# EAGLE design ButtonBoard (EAGLE 5.11)
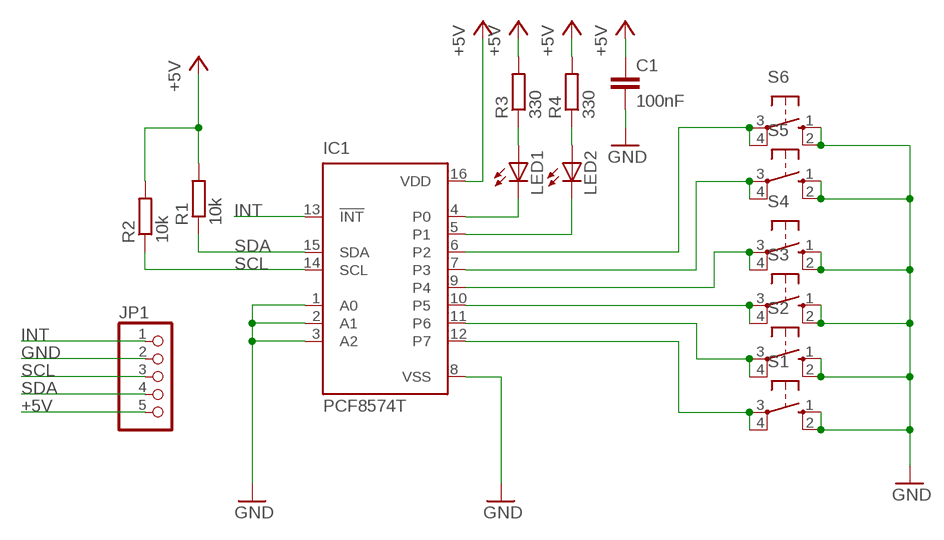
[diagram p0: schematic, sheet 1]

## Parts
C1  100nF  C-EUC0805  [C0805]
IC1  PCF8574T  [SO16W]
JP1  PINHD-1X5  [1X05]
LED1  LEDCHIPLED_1206  [CHIPLED_1206]
LED2  LEDCHIPLED_1206  [CHIPLED_1206]
R1  10k  R-EU_R0805  [R0805]
R2  10k  R-EU_R0805  [R0805]
R3  330  R-EU_R0805  [R0805]
R4  330  R-EU_R0805  [R0805]
S1  10-XX  [B3F-10XX]
S2  10-XX  [B3F-10XX]
S3  10-XX  [B3F-10XX]
S4  10-XX  [B3F-10XX]
S5  10-XX  [B3F-10XX]
S6  10-XX  [B3F-10XX]

## Nets
+5V: C1.1 IC1.16(VDD) JP1.5 R1.2 R2.2 R3.2 R4.2
GND: C1.2 IC1.1(A0) IC1.2(A1) IC1.3(A2) IC1.8(VSS) JP1.2 S1.1(S) S1.2(S1) S2.1(S) S2.2(S1) S3.1(S) S3.2(S1) S4.1(S) S4.2(S1) S5.1(S) S5.2(S1) S6.1(S) S6.2(S1)
INT: IC1.13(!INT) JP1.1
N$1: IC1.9(P4) S4.3(P) S4.4(P1)
N$2: IC1.5(P1) LED2.C
N$3: IC1.4(P0) LED1.C
N$4: LED1.A R3.1
N$5: IC1.12(P7) S1.3(P) S1.4(P1)
N$6: IC1.11(P6) S2.3(P) S2.4(P1)
N$7: IC1.10(P5) S3.3(P) S3.4(P1)
N$8: LED2.A R4.1
N$9: IC1.7(P3) S5.3(P) S5.4(P1)
N$10: IC1.6(P2) S6.3(P) S6.4(P1)
SCL: IC1.14(SCL) JP1.3 R2.1
SDA: IC1.15(SDA) JP1.4 R1.1

## Library data of the parts
C1 = rcl:C-EU: CAPACITOR, European symbol
IC1 = micro-philips:PCF8574: I2C-Bus Remote 8-bit I/O expander http://www.semiconductors.philips.com/acrobat_download/datasheets/PCF8574_4.pdf; MPN: PCF8574T/3,512; OC_FARNELL: 1201255; OC_NEWARK: 70R6870
JP1 = pinhead:PINHD-1X5: PIN HEADER
LED1 LED2 = led:LED: LED OSRAM: - CHIPLED LG R971, LG N971, LY N971, LG Q971, LY Q971, LO R971, LY R971 LH N974, LH R974 LS Q976, LO Q976, LY Q976 LO Q996 - Hyper CHIPLED LW Q18S LB Q993, LB Q99A, LB R99A - SideLED LS A670, LO A670, LY A670, LG A670, LP A670 LB A673, LV A673, LT A673, LW A673 LH A674 LY A675 LS A676, LA A676, LO A676, LY A676, LW A676 LS A679, LY A679, LG A679 - Hyper Micro SIDELED® LS Y876, LA Y876, LO Y876, LY Y876 LT Y87S - SmartLED LW L88C, LW L88S LB L89C, LB L89S, LG L890 LS L89K, LO L89K, LY L89K LS L896, LA L896, LO L896, LY L896 - TOPLED LS T670, LO T670, LY T670, LG T670, LP T670 LSG T670, LSP T670, LSY T670, LOP T670, LYG T670 LG T671, LOG T671, LSG T671 LB T673, LV T673, LT T673, LW T673 LH T674 LS T676, LA T676, LO T676, LY T676, LB T676, LH T676, LSB T676, LW T676 LB T67C, LV T67C, LT T67C, LS T67K, LO T67K, LY T67K, LW E67C LS E67B, LA E67B, LO E67B, LY E67B, LB E67C, LV E67C, LT E67C LW T67C LS T679, LY T679, LG T679 LS T770, LO T770, LY T770, LG T770, LP T770 LB T773, LV T773, LT T773, LW T773 LH T774 LS E675, LA E675, LY E675, LS T675 LS T776, LA T776, LO T776, LY T776, LB T776 LHGB T686 LT T68C, LB T68C - Hyper Mini TOPLED® LB M676 - Mini TOPLED Santana® LG M470 LS M47K, LO M47K, LY M47K Source: http://www.osram.convergy.de LUXEON: - LUMILED® LXK2-PW12-R00, LXK2-PW12-S00, LXK2-PW14-U00, LXK2-PW14-V00 LXK2-PM12-R00, LXK2-PM12-S00, LXK2-PM14-U00 LXK2-PE12-Q00, LXK2-PE12-R00, LXK2-PE12-S00, LXK2-PE14-T00, LXK2-PE14-U00 LXK2-PB12-K00, LXK2-PB12-L00, LXK2-PB12-M00, LXK2-PB14-N00, LXK2-PB14-P00, LXK2-PB14-Q00 LXK2-PR12-L00, LXK2-PR12-M00, LXK2-PR14-Q00, LXK2-PR14-R00 LXK2-PD12-Q00, LXK2-PD12-R00, LXK2-PD12-S00 LXK2-PH12-R00, LXK2-PH12-S00 LXK2-PL12-P00, LXK2-PL12-Q00, LXK2-PL12-R00 Source: www.luxeon.com KINGBRIGHT: KA-3528ASYC Source: www.kingbright.com
R1-R4 = rcl:R-EU_: RESISTOR, European symbol
S1-S6 = switch-omron:10-XX: OMRON SWITCH; MPN: B3F-1000; OC_FARNELL: 176432; OC_NEWARK: 36M3542

## Board
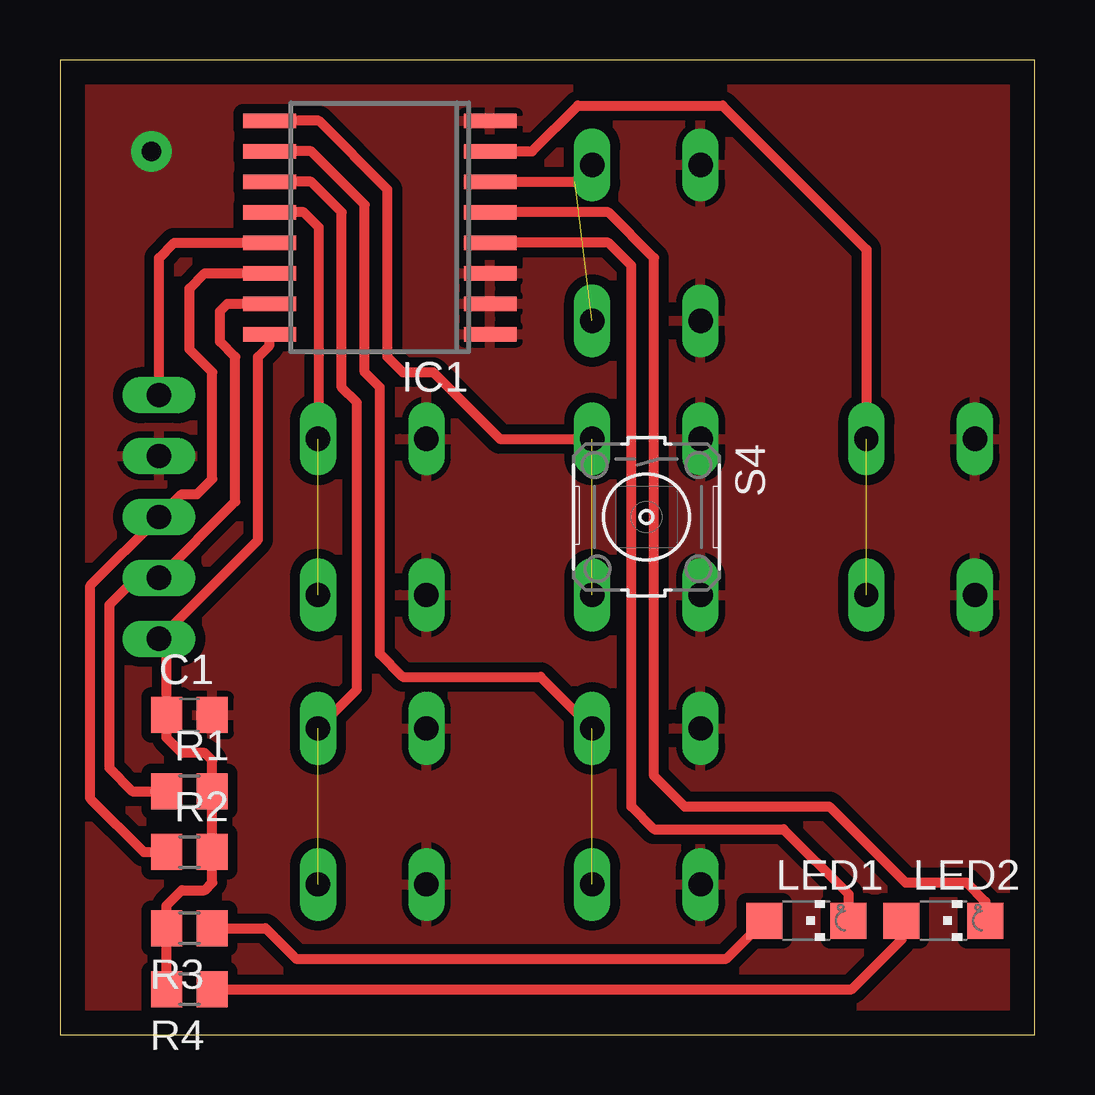
[diagram p1: board, top side]
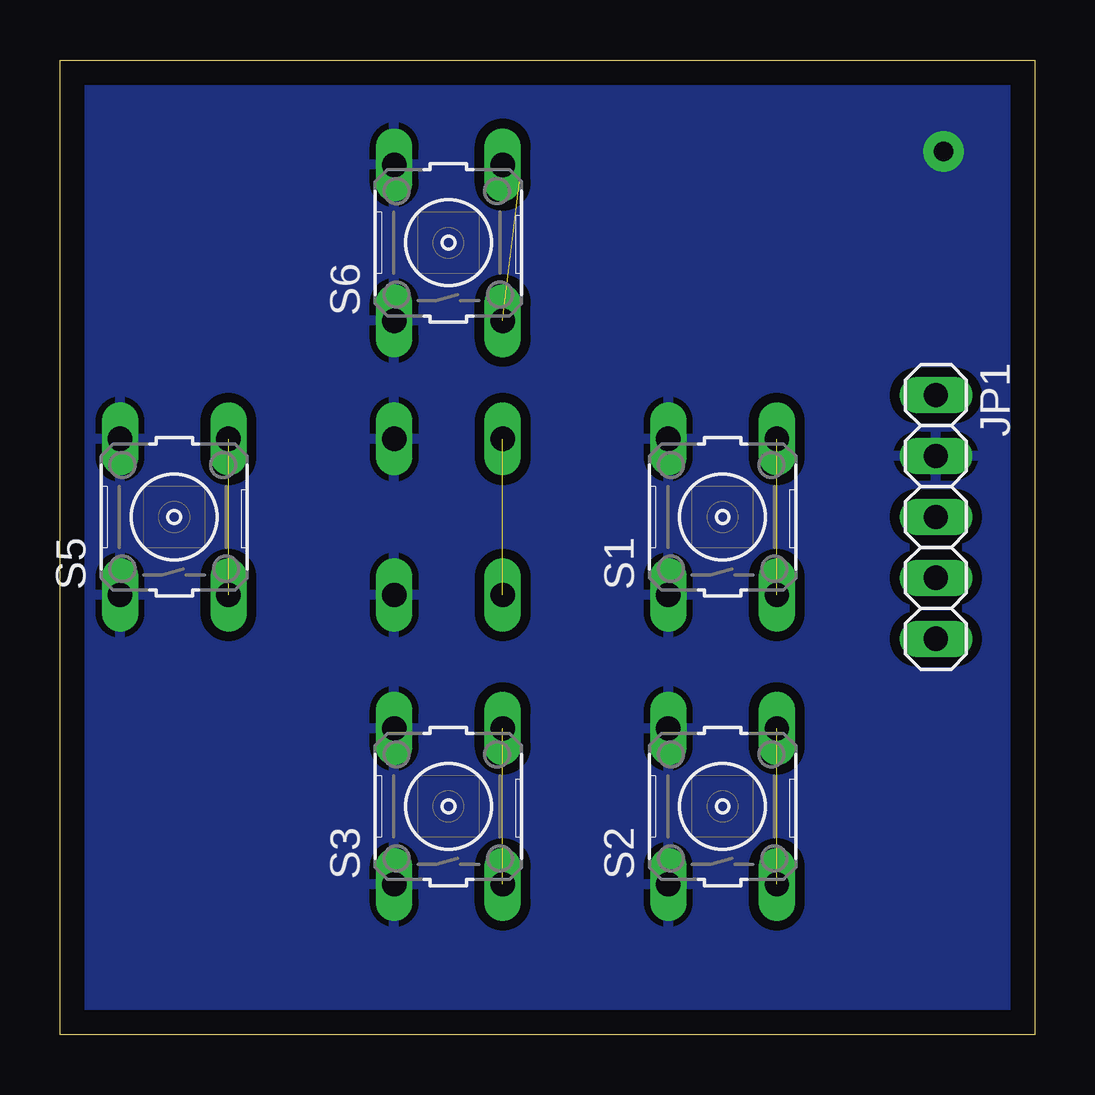
[diagram p2: board, bottom side, seen from below]

Size 40.64 x 40.64 mm. Coordinates in mm from the lower left corner, seen from the top.
Outline: 0,0 40.64,0 40.64,40.64 0,40.64 0,0
Copper layers (1*16): Top 0.035mm / dielectric 1.5mm / Bottom 0.035mm
Design rules "default *": minimum track width 10mil, minimum drill 24mil, track to track 12mil, track to pad 8mil, pad to pad 8mil, via to via 8mil, smd to smd 8mil, copper to edge 40mil, drill to drill 8mil, minimum pad ring 10mil, minimum via ring 8mil, stop-mask expansion 4mil, vias tented up to drill 0mil, thermal gap 10mil

### Footprints (pad centres in the part's own frame; a part is rotated, then mirrored left to right if it is on the bottom)
C0805 = smd 1.3 x 1.5: 1 -0.95,0; 2 0.95,0
SO16W = smd 0.6 x 2.2: 1 -4.445,-4.6; 2 -3.175,-4.6; 3 -1.905,-4.6; 4 -0.635,-4.6; 5 0.635,-4.6; 6 1.905,-4.6; 7 3.175,-4.6; 8 4.445,-4.6; 9 4.445,4.6; 10 3.175,4.6; 11 1.905,4.6; 12 0.635,4.6; 13 -0.635,4.6; 14 -1.905,4.6; 15 -3.175,4.6; 16 -4.445,4.6
1X05 = drill 1.016 long: 1 -5.08,0; 2 -2.54,0; 3 0,0; 4 2.54,0; 5 5.08,0
CHIPLED_1206 = smd 1.5 x 1.5: A 0,-1.75; C 0,1.75
R0805 = smd 1.3 x 1.5: 1 -0.95,0; 2 0.95,0
B3F-10XX = drill 1.016 long: 1 -3.251,2.261; 2 3.251,2.261; 3 -3.251,-2.261; 4 3.251,-2.261

### Placement (x,y rotation side)
C1  5.4,13.34 0 top
IC1  13.34,33.66 90 top
JP1  4.13,21.59 270 bottom
LED1  31.11,4.76 270 top
LED2  36.83,4.76 270 top
R1  5.4,10.16 0 top
R2  5.4,7.62 0 top
R3  5.4,4.45 180 top
R4  5.4,1.91 180 top
S1  13.02,21.59 90 bottom
S2  13.02,9.53 90 bottom
S3  24.45,9.53 90 bottom
S4  24.45,21.59 270 top
S5  35.88,21.59 90 bottom
S6  24.45,33.02 90 bottom

### Tracks (layer width: path | path; a pad name or v marks a point on that pad's centre or on a via)
+5V
  Top 0.406: IC1.16 8.73,28.74 8.26,28.26 8.26,20.64 JP1.5 4.45,16.19 C1.1 4.45,12.38 5.08,11.75 6.03,11.75 6.35,11.43 R1.2 R2.2 6.35,6.35 6.03,6.03 5.08,6.03 4.45,5.4 R3.2 R4.2
GND  (via drill 0.8 pad 1.68)
  other vias: 3.81,36.83
  pour Top (isolate 0.406): 0,0 40.64,0 40.64,40.64 0,40.64
  pour Bottom (isolate 0.406): 40.64,40.64 0,40.64 0,0 40.64,0
INT
  Top 0.406: JP1.1 4.13,32.38 4.76,33.02 IC1.13
N$1  (1 unrouted)
  Top 0.406: IC1.9 10.79,38.1 13.65,35.24 13.65,28.26 14.29,27.62 15.56,27.62 18.34,24.84 S4.3
N$2
  Top 0.406: IC1.5 22.86,34.29 24.77,32.38 24.77,10.79 26.04,9.53 32.07,9.53 35.24,6.35 37.78,6.35 38.58,5.55 LED2.C
N$3
  Top 0.406: IC1.4 22.86,33.02 23.81,32.07 23.81,9.53 24.77,8.57 30.16,8.57 32.87,5.87 LED1.C
N$4
  Top 0.406: R3.1 8.57,4.45 9.84,3.17 27.78,3.17 LED1.A
N$5  (1 unrouted)
  Top 0.406: IC1.12 10.16,34.29 10.79,33.66 10.79,24.88 S1.4
N$6  (1 unrouted)
  Top 0.406: IC1.11 10.48,35.56 11.75,34.29 11.75,26.99 12.38,26.35 12.38,14.4 S2.4
N$7  (1 unrouted)
  Top 0.406: IC1.10 10.48,36.83 12.7,34.61 12.7,27.62 13.34,26.99 13.34,15.88 14.29,14.92 20.04,14.92 S3.4
N$8
  Top 0.406: R4.1 33.02,1.91 35.08,3.96 LED2.A
N$9  (1 unrouted)
  Top 0.406: IC1.7 19.68,36.83 21.59,38.73 27.62,38.73 33.62,32.74 S5.4
N$10  (1 unrouted)
  Top 0.406: IC1.6 21.48,35.56 S6.4
SCL
  Top 0.406: IC1.14 6.03,31.75 5.4,31.11 5.4,28.57 6.35,27.62 6.35,23.18 5.71,22.54 5.08,22.54 JP1.3 1.27,18.73 1.27,9.84 3.49,7.62 R2.1
SDA
  Top 0.406: IC1.15 6.99,30.48 6.67,30.16 6.67,28.89 7.3,28.26 7.3,22.23 JP1.4 3.18,19.05 2.07,17.94 2.07,11.11 3.02,10.16 R1.1